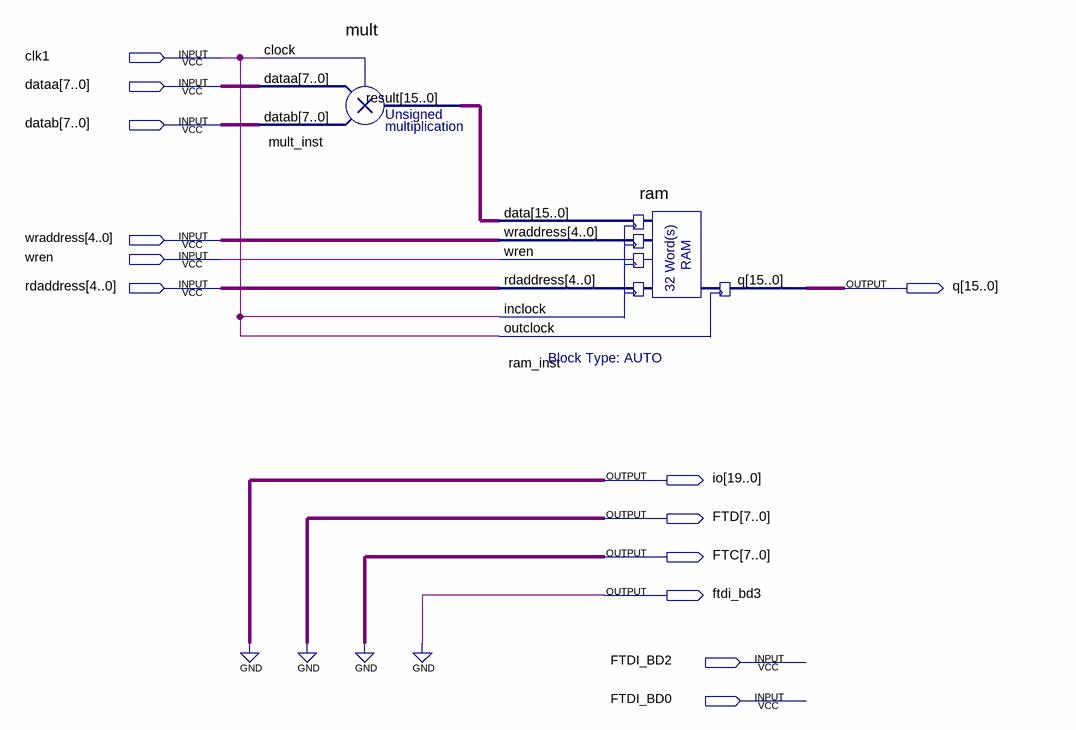
[diagram p0: schematic sheet]
// Quartus schematic pipemult2.bdf as structural Verilog: 2 symbols, 13 pins
module pipemult2 (
  input  clk1,
  input  [7:0] dataa,
  input  [7:0] datab,
  input  [4:0] wraddress,
  input  wren,
  input  [4:0] rdaddress,
  input  FTDI_BD2,
  input  FTDI_BD0,
  output [15:0] q,
  output [19:0] io,
  output [7:0] FTD,
  output [7:0] FTC,
  output ftdi_bd3
);

  wire [15:0] mult_inst_result;

  mult mult_inst (.dataa(dataa), .datab(datab), .clock(clk1), .result(mult_inst_result));
  ram ram_inst (
    .data(mult_inst_result), .wraddress(wraddress), .wren(wren), .rdaddress(rdaddress), .inclock(clk1),
    .outclock(clk1), .q(q));

  assign FTC = {8{1'b0}};
  assign FTD = {8{1'b0}};
  assign ftdi_bd3 = 1'b0;
  assign io = {20{1'b0}};
endmodule
